# Altium schematic sheet Synapse(all).SchDoc
size A4; SheetNumber: 1; SheetTotal: 4
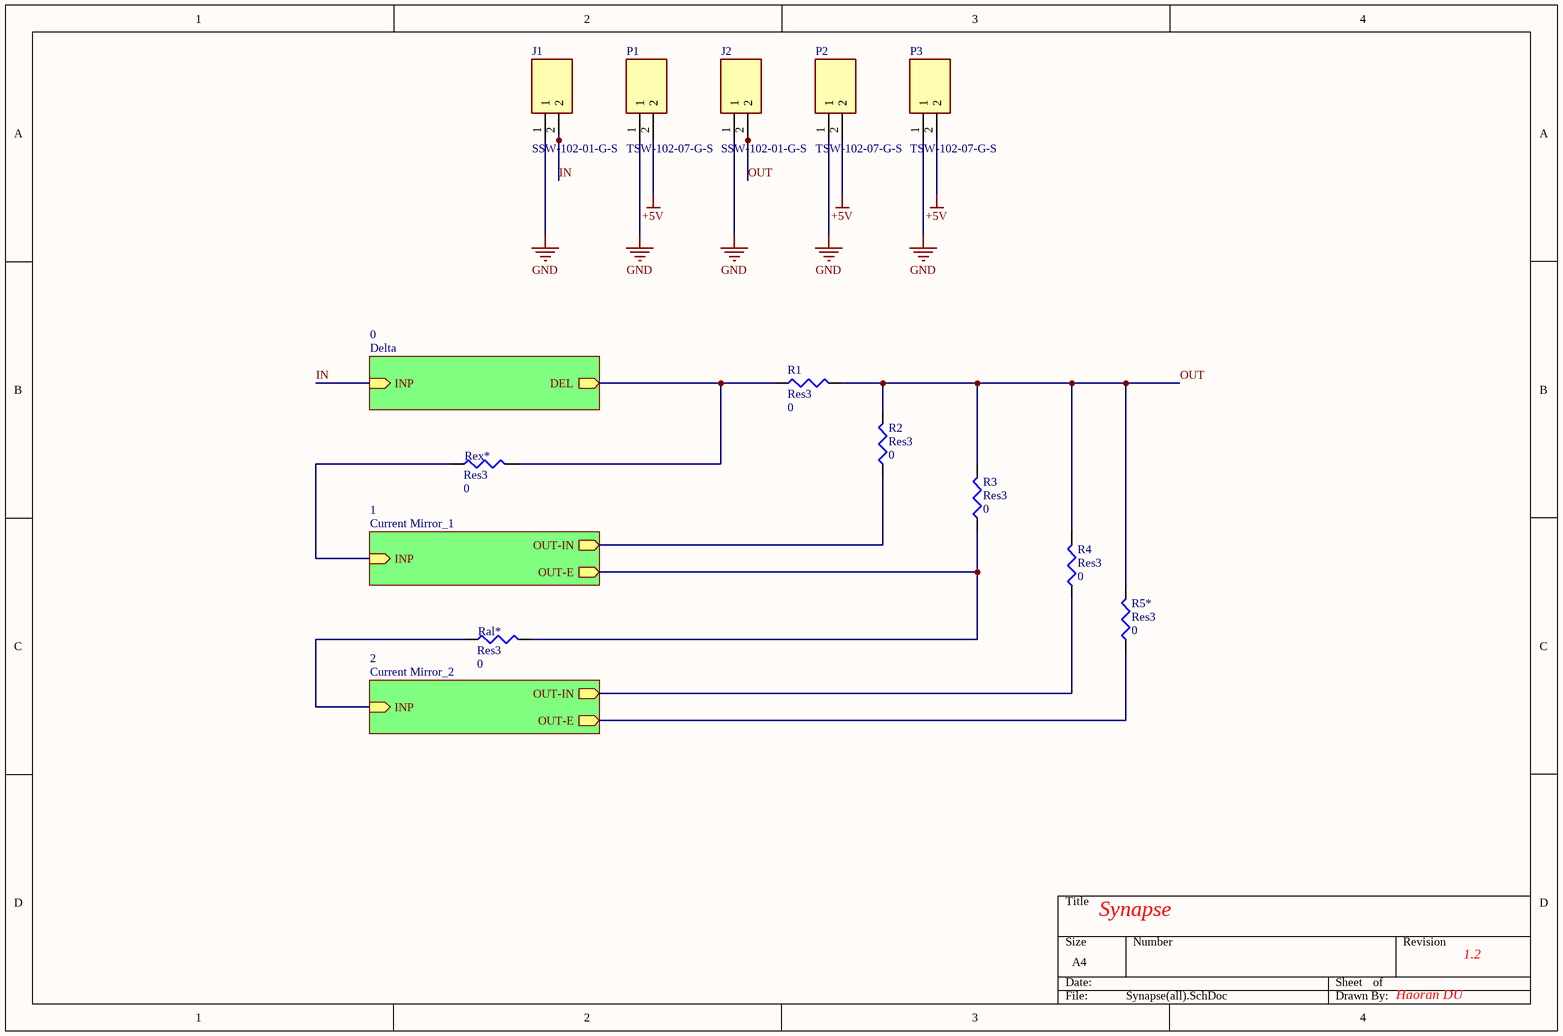
[diagram p0: Synapse(all).SchDoc]

## Parts
J1  SSW-102-01-G-S  [SSW-102-XX-YYY-S]
J2  SSW-102-01-G-S  [SSW-102-XX-YYY-S]
P1  TSW-102-07-G-S  [TSW-102-XX-YY-S]
P2  TSW-102-07-G-S  [TSW-102-XX-YY-S]
P3  TSW-102-07-G-S  [TSW-102-XX-YY-S]
R1  Res3  value 0  [J1-0603]
R2  Res3  value 0  [J1-0603]
R3  Res3  value 0  [J1-0603]
R4  Res3  value 0  [J1-0603]
R5*  Res3  value 0  [J1-0603]
Ral*  Res3  value 0  [J1-0603]
Rex*  Res3  value 0  [J1-0603]

## Sub-sheets
0 = Delta: INP (in), DEL (out)
1 = Current Mirror_1: INP (in), OUT-E (out), OUT-IN (out)
2 = Current Mirror_2: INP (in), OUT-E (out), OUT-IN (out)

## Nets
+5V: P1.2 P2.2 P3.2
GND: J1.1 J2.1 P1.1 P2.1 P3.1
IN: J1.2 ; sheet 0/INP
OUT: J2.2 R1.2 R2.2 R3.2 R4.2 R5*.2
NetR1_1: R1.1 Rex*.2 ; sheet 0/DEL
NetR2_1: R2.1 ; sheet 1/OUT-IN
NetR3_1: R3.1 Ral*.2 ; sheet 1/OUT-E
NetR4_1: R4.1 ; sheet 2/OUT-IN
NetR5*_1: R5*.1 ; sheet 2/OUT-E
NetRal*_1: Ral*.1 ; sheet 2/INP
NetRex*_1: Rex*.1 ; sheet 1/INP

## Notes on the sheet
- Synapse
- 1.2
- Haoran DU

## Library data of the parts
J1 J2 = SSW-102-01-G-S: Connector; Manufacturer_Name: SAMTEC; Datasheet Link: http://suddendocs.samtec.com/prints/ssw-1xx-xx-xxx-x-xx-xxx-xx-mkt.pdf; Height: 8.51mm; Manufacturer_Part_Number: SSW-102-01-G-S; Mouser Part Number: 200-SSW10201GS; Mouser Price/Stock: https://www.mouser.co.uk/ProductDetail/Samtec/SSW-102-01-G-S?qs=92ilVni64gwMaw8Iglb9kA%3D%3D; Arrow Part Number: SSW-102-01-G-S; Arrow Price/Stock: https://www.arrow.com/en/products/ssw-102-01-g-s/samtec?region=europe
P1-P3 = TSW-102-07-G-S: Connector; Manufacturer_Name: SAMTEC; Datasheet Link: http://suddendocs.samtec.com/prints/tsw-xxx-xx-xxx-x-xx-xxx-mkt.pdf; Manufacturer_Part_Number: TSW-102-07-G-S; Mouser Part Number: 200-TSW10207GS; Mouser Price/Stock: https://www.mouser.co.uk/ProductDetail/Samtec/TSW-102-07-G-S?qs=iT52DjcXudsNPhlNCDp8vw%3D%3D; Arrow Part Number: TSW-102-07-G-S; Arrow Price/Stock: https://www.arrow.com/en/products/tsw-102-07-g-s/samtec?region=europe
R1-R4 R5* Ral* Rex* = Res3: Resistor; Published: 8-Jun-2000; LatestRevisionDate: 29-May-2009; LatestRevisionNote: IPC-7351 Footprint Added.; PackageReference: J1-0603; Publisher: Altium Limited; PackageDescription: Chip Resistor